# EAGLE design shieldv1 (EAGLE 6.4)
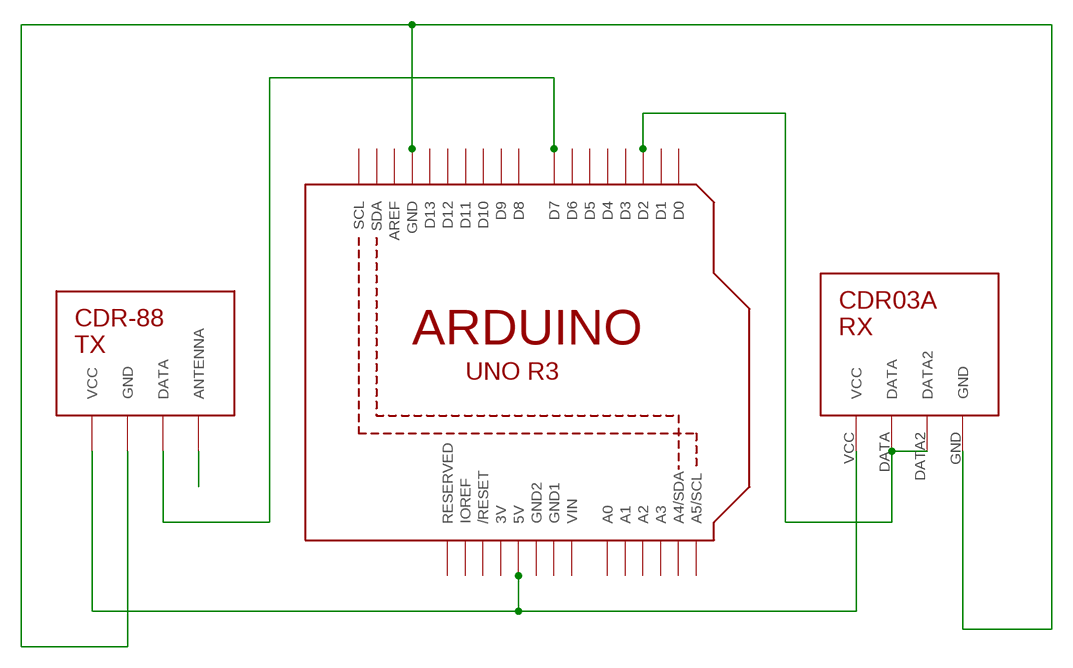
[diagram p0: schematic, sheet 1]

## Parts
U2  ARDUINOR3-DIMENSION  [ARDUINOR3]
U$1  CDT-88  [CDT-88]
U$2  CDR03A  [CDR03A]

## Nets
N$1: U2.D7 U$1.DATA
N$2: U2.D2 U$2.DATA U$2.DATA2
N$5: U2.5V U$1.VCC U$2.VCC
N$7: U$1.ANTENNA
N$69: U2.GND U$1.GND U$2.GND
Unconnected: U2.A0 U2.A1 U2.A2 U2.A3 U2.A4(A4/SDA) U2.A5(A5/SCL) U2.AREF U2.D0 U2.D1 U2.D3 U2.D4 U2.D5 U2.D6 U2.D8 U2.D9 U2.D10 U2.D11 U2.D12 U2.D13 U2.IOREF U2.RESERVED U2.RESET(/RESET) U2.SCL U2.SDA

## Power pins joined to a net without a drawn wire
3V: U2.3V
GND1: U2.GND1
GND2: U2.GND2
VIN: U2.VIN

## Library data of the parts
U2 = adafruit:ARDUINOR3: This is a new object for the new Arduino R3 - with extra pins that you may want to use (such as IOref, and duplicated A4/A5
U$1 = RF-transrec:CDT-88
U$2 = RF-transrec:CDR03A

## Board
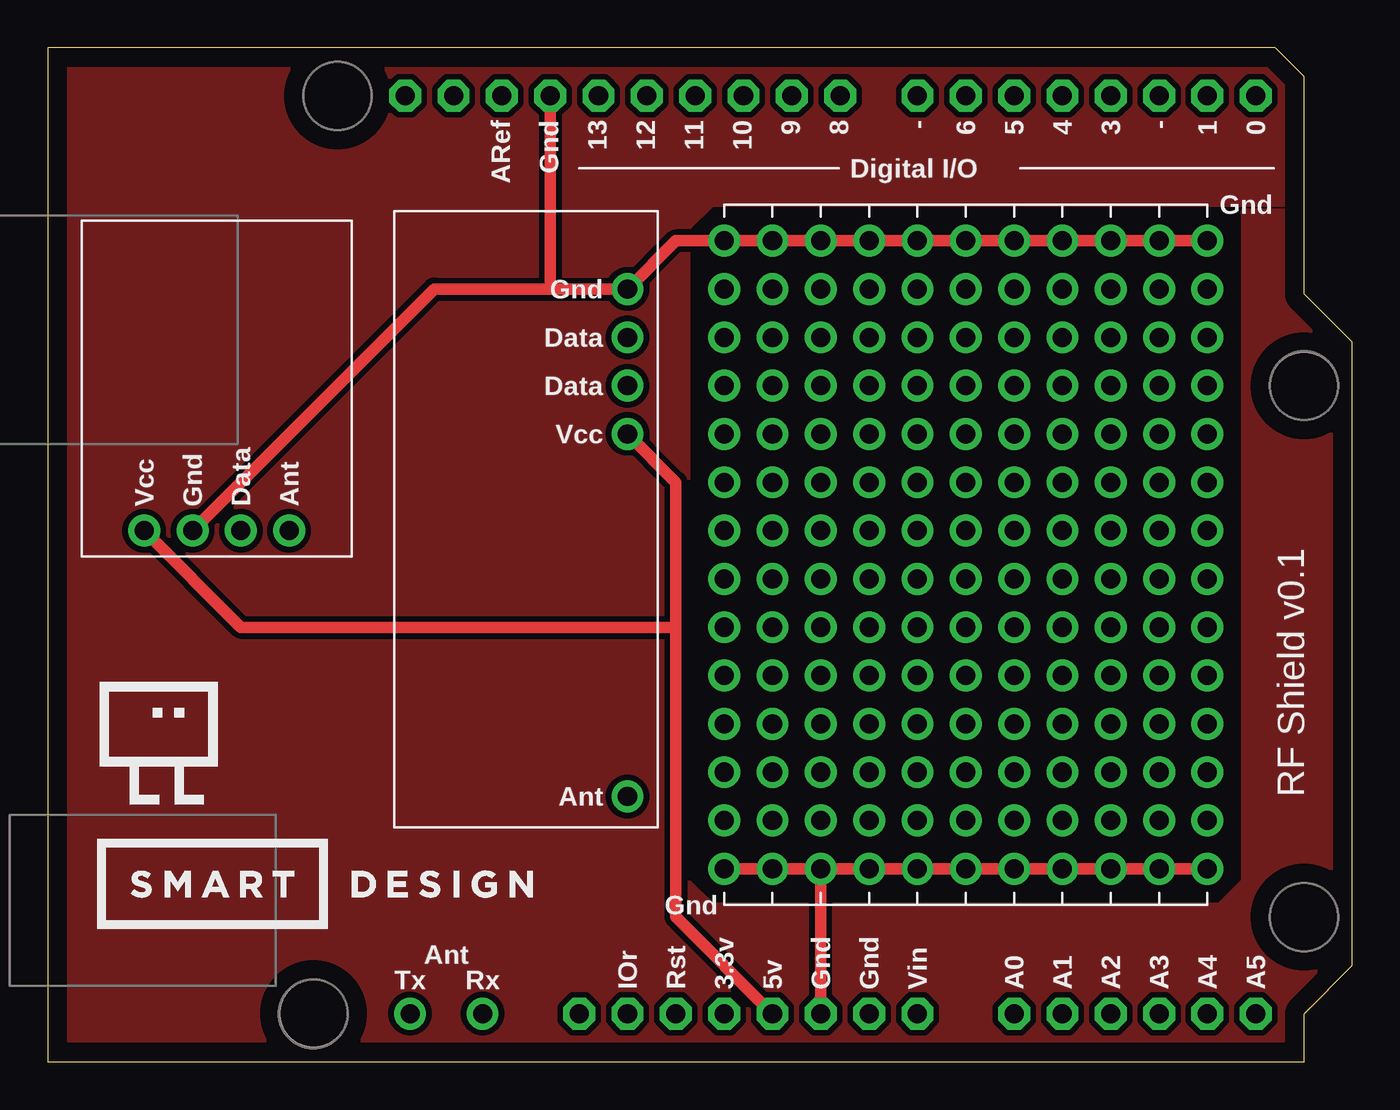
[diagram p1: board, top side]
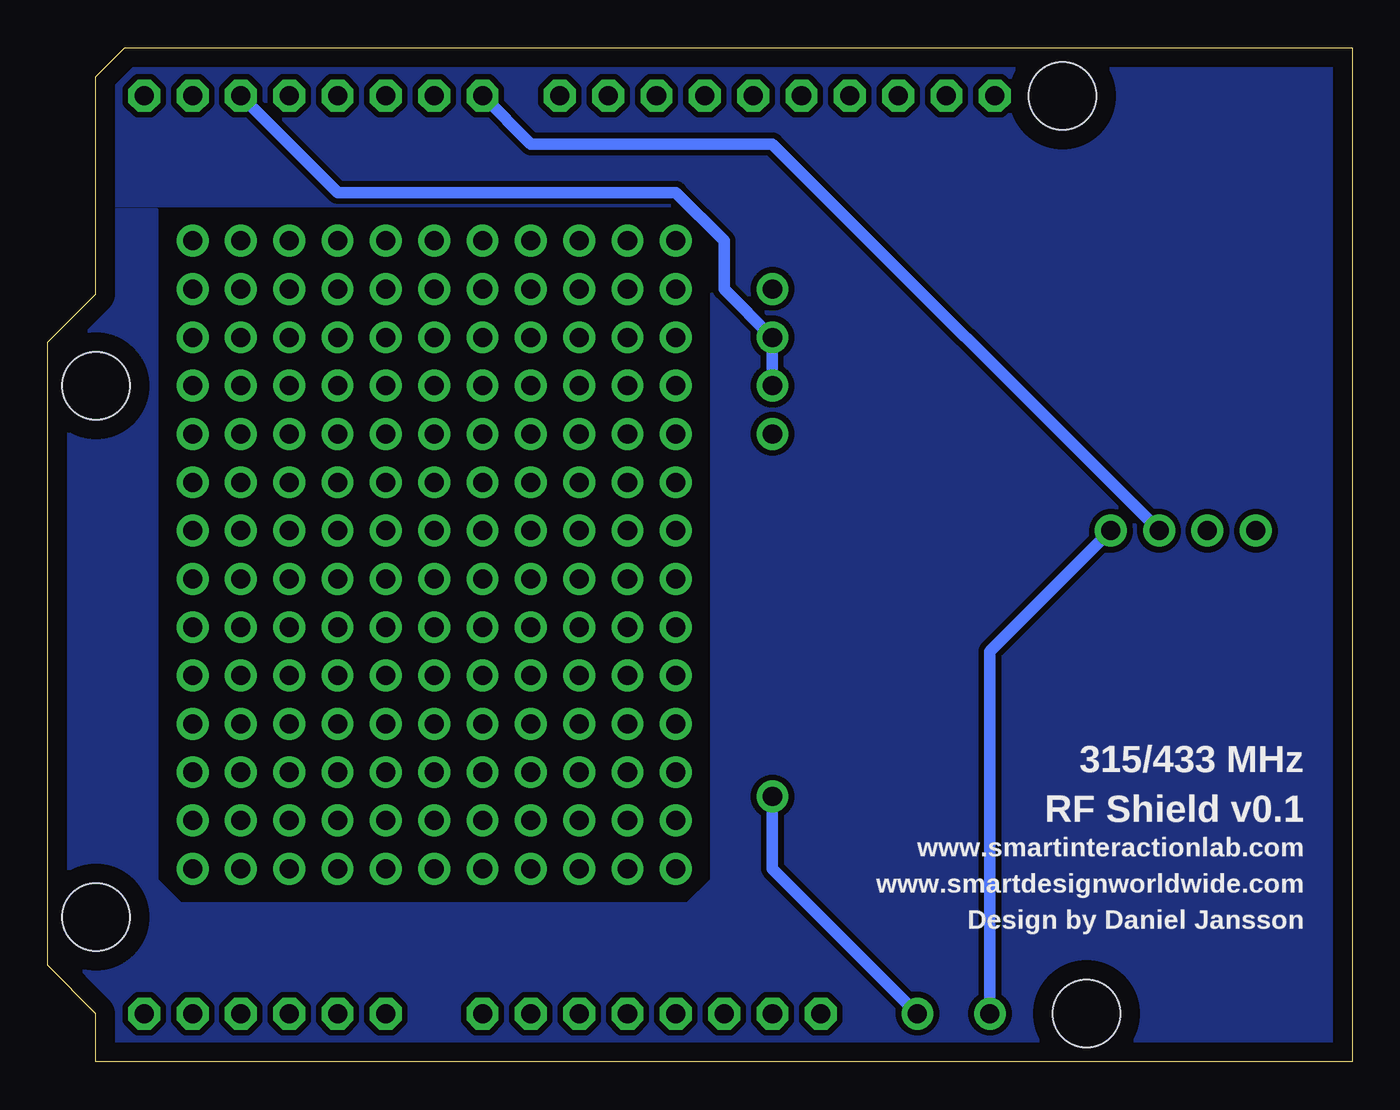
[diagram p2: board, bottom side, seen from below]

Size 68.58 x 53.34 mm. Coordinates in mm from the lower left corner, seen from the top.
Copper layers (1*16): Top 0.035mm / dielectric 1.5mm / Bottom 0.035mm
Design rules "default": minimum track width 10mil, minimum drill 24mil, track to track 8mil, track to pad 8mil, pad to pad 8mil, via to via 8mil, smd to smd 8mil, copper to edge 40mil, drill to drill 8mil, minimum pad ring 10mil, minimum via ring 8mil, stop-mask expansion 4mil, vias tented up to drill 0mil, thermal gap 10mil
Holes 3.56 mm at 13.97,2.54 66.04,7.62 66.04,35.56 15.24,50.8

### Footprints (pad centres in the part's own frame; a part is rotated, then mirrored left to right if it is on the bottom)
ARDUINOR3 = drill 1 pad 1.676 octagon: 3V 35.56,2.54; 5V 38.1,2.54; A0 50.8,2.54; A1 53.34,2.54; A2 55.88,2.54; A3 58.42,2.54; A4 60.96,2.54; A5 63.5,2.54; AREF 23.876,50.8; D0 63.5,50.8; D1 60.96,50.8; D2 58.42,50.8; D3 55.88,50.8; D4 53.34,50.8; D5 50.8,50.8; D6 48.26,50.8; D7 45.72,50.8; D8 41.656,50.8; D9 39.116,50.8; D10 36.576,50.8; D11 34.036,50.8; D12 31.496,50.8; D13 28.956,50.8; GND 26.416,50.8; GND1 43.18,2.54; GND2 40.64,2.54; IOREF 30.48,2.54; RESERVED 27.94,2.54; RESET 33.02,2.54; SCL 18.796,50.8; SDA 21.336,50.8; VIN 45.72,2.54
CDT-88 = drill 1 pad 1.676: ANTENNA 7.62,0; DATA 5.08,0; GND 2.54,0; VCC 0,0
CDR03A = drill 1 pad 1.676: DATA 2.54,0; DATA2 5.08,0; GND 7.62,0; P$2 -19.06,0; VCC 0,0

### Placement (x,y rotation side)
U2  0,0 0 top
U$1  5.08,27.94 0 top
U$2  30.48,33.02 90 top

### Tracks (layer width: path | path; a pad name or v marks a point on that pad's centre or on a via)
GND
  pour Top (isolate 0.305): 0,53.34 64.45,53.34 66.04,51.75 66.04,45.09 34.93,45.09 33.66,43.82 33.66,9.53 34.93,8.26 61.59,8.26 62.86,9.53 62.86,44.77 66.04,44.77 66.04,40.32 68.58,37.78 68.58,5.08 66.04,2.54 66.04,0 0,0
  pour Bottom (isolate 0.305): 0,53.34 64.45,53.34 66.04,51.75 66.04,45.09 34.93,45.09 33.66,43.82 33.66,9.53 34.93,8.26 61.59,8.26 62.86,9.53 62.86,44.77 66.04,44.77 66.04,40.32 68.58,37.78 68.58,5.08 66.04,2.54 66.04,0 0,0
GND2  (via drill 1 pad 1.68)
  Top 0.61: v35.56,10.16 v38.1,10.16 v40.64,10.16 | v40.64,10.16 v43.18,10.16 v45.72,10.16 v48.26,10.16 v50.8,10.16 v53.34,10.16 v55.88,10.16 v58.42,10.16 v60.96,10.16 | U2.GND2 v40.64,10.16
N$1
  Bottom 0.61: U2.D7 43.18,48.26 30.48,48.26 U$1.DATA
N$2
  Bottom 0.61: U2.D2 53.34,45.72 35.56,45.72 33.02,43.18 33.02,40.64 U$2.DATA2 U$2.DATA
N$4  (via drill 1 pad 1.68)
  Bottom 0.61: 30.48,13.97 30.48,10.16 v22.86,2.54
N$5
  Top 0.61: U$2.VCC 33.02,30.48 33.02,22.86 | 33.02,22.86 33.02,7.62 U2.5V | U$1.VCC 10.16,22.86 33.02,22.86
N$7  (via drill 1 pad 1.68)
  Bottom 0.61: U$1.ANTENNA 19.05,21.59 v19.05,2.54
N$27  (via drill 1 pad 1.68)
  other vias: 35.56,12.7
N$28  (via drill 1 pad 1.68)
  other vias: 38.1,12.7
N$29  (via drill 1 pad 1.68)
  other vias: 40.64,12.7
N$30  (via drill 1 pad 1.68)
  other vias: 43.18,12.7
N$31  (via drill 1 pad 1.68)
  other vias: 45.72,12.7
N$32  (via drill 1 pad 1.68)
  other vias: 48.26,12.7
N$33  (via drill 1 pad 1.68)
  other vias: 53.34,12.7
N$34  (via drill 1 pad 1.68)
  other vias: 50.8,12.7
N$35  (via drill 1 pad 1.68)
  other vias: 55.88,12.7
N$36  (via drill 1 pad 1.68)
  other vias: 58.42,12.7
N$37  (via drill 1 pad 1.68)
  other vias: 60.96,12.7
N$38  (via drill 1 pad 1.68)
  other vias: 60.96,15.24
N$39  (via drill 1 pad 1.68)
  other vias: 58.42,15.24
N$40  (via drill 1 pad 1.68)
  other vias: 55.88,15.24
N$41  (via drill 1 pad 1.68)
  other vias: 53.34,15.24
N$42  (via drill 1 pad 1.68)
  other vias: 50.8,15.24
N$43  (via drill 1 pad 1.68)
  other vias: 48.26,15.24
N$44  (via drill 1 pad 1.68)
  other vias: 45.72,15.24
N$45  (via drill 1 pad 1.68)
  other vias: 43.18,15.24
N$46  (via drill 1 pad 1.68)
  other vias: 40.64,15.24
N$47  (via drill 1 pad 1.68)
  other vias: 38.1,15.24
N$48  (via drill 1 pad 1.68)
  other vias: 35.56,15.24
N$49  (via drill 1 pad 1.68)
  other vias: 35.56,17.78
N$50  (via drill 1 pad 1.68)
  other vias: 38.1,17.78
N$51  (via drill 1 pad 1.68)
  other vias: 40.64,17.78
N$52  (via drill 1 pad 1.68)
  other vias: 43.18,17.78
N$53  (via drill 1 pad 1.68)
  other vias: 45.72,17.78
N$54  (via drill 1 pad 1.68)
  other vias: 48.26,17.78
N$55  (via drill 1 pad 1.68)
  other vias: 50.8,17.78
N$56  (via drill 1 pad 1.68)
  other vias: 53.34,17.78
N$57  (via drill 1 pad 1.68)
  other vias: 55.88,17.78
N$58  (via drill 1 pad 1.68)
  other vias: 58.42,17.78
N$59  (via drill 1 pad 1.68)
  other vias: 60.96,17.78
N$60  (via drill 1 pad 1.68)
  other vias: 35.56,20.32
N$61  (via drill 1 pad 1.68)
  other vias: 35.56,22.86
N$62  (via drill 1 pad 1.68)
  other vias: 35.56,25.4
N$63  (via drill 1 pad 1.68)
  other vias: 35.56,27.94
N$64  (via drill 1 pad 1.68)
  other vias: 35.56,30.48
N$65  (via drill 1 pad 1.68)
  other vias: 35.56,33.02
N$66  (via drill 1 pad 1.68)
  other vias: 35.56,35.56
N$67  (via drill 1 pad 1.68)
  other vias: 35.56,38.1
N$68  (via drill 1 pad 1.68)
  other vias: 35.56,40.64
N$69  (via drill 1 pad 1.68)
  Top 0.254: 26.42,40.64
  Top 0.61: v60.96,43.18 v58.42,43.18 v55.88,43.18 v53.34,43.18 v50.8,43.18 v48.26,43.18 v45.72,43.18 v43.18,43.18 v40.64,43.18 v38.1,43.18 v35.56,43.18 33.02,43.18 U$2.GND 26.42,40.64 20.32,40.64 U$1.GND | U2.GND 26.42,40.64
N$82  (via drill 1 pad 1.68)
  other vias: 60.96,40.64
N$83  (via drill 1 pad 1.68)
  other vias: 60.96,38.1
N$84  (via drill 1 pad 1.68)
  other vias: 60.96,35.56
N$85  (via drill 1 pad 1.68)
  other vias: 60.96,33.02
N$86  (via drill 1 pad 1.68)
  other vias: 60.96,30.48
N$87  (via drill 1 pad 1.68)
  other vias: 60.96,27.94
N$88  (via drill 1 pad 1.68)
  other vias: 60.96,25.4
N$89  (via drill 1 pad 1.68)
  other vias: 60.96,22.86
N$90  (via drill 1 pad 1.68)
  other vias: 60.96,20.32
N$91  (via drill 1 pad 1.68)
  other vias: 58.42,20.32
N$92  (via drill 1 pad 1.68)
  other vias: 55.88,20.32
N$93  (via drill 1 pad 1.68)
  other vias: 53.34,20.32
N$94  (via drill 1 pad 1.68)
  other vias: 50.8,20.32
N$95  (via drill 1 pad 1.68)
  other vias: 48.26,20.32
N$96  (via drill 1 pad 1.68)
  other vias: 45.72,20.32
N$97  (via drill 1 pad 1.68)
  other vias: 43.18,20.32
N$98  (via drill 1 pad 1.68)
  other vias: 40.64,20.32
N$99  (via drill 1 pad 1.68)
  other vias: 38.1,20.32
N$100  (via drill 1 pad 1.68)
  other vias: 38.1,22.86
N$101  (via drill 1 pad 1.68)
  other vias: 40.64,22.86
N$102  (via drill 1 pad 1.68)
  other vias: 43.18,22.86
N$103  (via drill 1 pad 1.68)
  other vias: 45.72,22.86
N$104  (via drill 1 pad 1.68)
  other vias: 50.8,22.86
N$105  (via drill 1 pad 1.68)
  other vias: 48.26,22.86
N$106  (via drill 1 pad 1.68)
  other vias: 53.34,22.86
N$107  (via drill 1 pad 1.68)
  other vias: 55.88,22.86
N$108  (via drill 1 pad 1.68)
  other vias: 58.42,22.86
N$109  (via drill 1 pad 1.68)
  other vias: 58.42,25.4
N$110  (via drill 1 pad 1.68)
  other vias: 55.88,25.4
N$111  (via drill 1 pad 1.68)
  other vias: 53.34,25.4
N$112  (via drill 1 pad 1.68)
  other vias: 50.8,25.4
N$113  (via drill 1 pad 1.68)
  other vias: 48.26,25.4
N$114  (via drill 1 pad 1.68)
  other vias: 45.72,25.4
N$115  (via drill 1 pad 1.68)
  other vias: 43.18,25.4
N$116  (via drill 1 pad 1.68)
  other vias: 40.64,25.4
N$117  (via drill 1 pad 1.68)
  other vias: 38.1,25.4
N$118  (via drill 1 pad 1.68)
  other vias: 38.1,27.94
N$119  (via drill 1 pad 1.68)
  other vias: 40.64,27.94
N$120  (via drill 1 pad 1.68)
  other vias: 43.18,27.94
N$121  (via drill 1 pad 1.68)
  other vias: 45.72,27.94
N$122  (via drill 1 pad 1.68)
  other vias: 48.26,27.94
N$123  (via drill 1 pad 1.68)
  other vias: 50.8,27.94
N$124  (via drill 1 pad 1.68)
  other vias: 53.34,27.94
N$125  (via drill 1 pad 1.68)
  other vias: 55.88,27.94
N$126  (via drill 1 pad 1.68)
  other vias: 58.42,27.94
N$127  (via drill 1 pad 1.68)
  other vias: 58.42,30.48
N$128  (via drill 1 pad 1.68)
  other vias: 55.88,30.48
N$129  (via drill 1 pad 1.68)
  other vias: 53.34,30.48
N$130  (via drill 1 pad 1.68)
  other vias: 50.8,30.48
N$131  (via drill 1 pad 1.68)
  other vias: 48.26,30.48
N$132  (via drill 1 pad 1.68)
  other vias: 45.72,30.48
N$133  (via drill 1 pad 1.68)
  other vias: 43.18,30.48
N$134  (via drill 1 pad 1.68)
  other vias: 40.64,30.48
N$135  (via drill 1 pad 1.68)
  other vias: 38.1,30.48
N$136  (via drill 1 pad 1.68)
  other vias: 38.1,33.02
N$137  (via drill 1 pad 1.68)
  other vias: 40.64,33.02
N$138  (via drill 1 pad 1.68)
  other vias: 43.18,33.02
N$139  (via drill 1 pad 1.68)
  other vias: 45.72,33.02
N$140  (via drill 1 pad 1.68)
  other vias: 48.26,33.02
N$141  (via drill 1 pad 1.68)
  other vias: 50.8,33.02
N$142  (via drill 1 pad 1.68)
  other vias: 53.34,33.02
N$143  (via drill 1 pad 1.68)
  other vias: 55.88,33.02
N$144  (via drill 1 pad 1.68)
  other vias: 58.42,33.02
N$145  (via drill 1 pad 1.68)
  other vias: 58.42,35.56
N$146  (via drill 1 pad 1.68)
  other vias: 55.88,35.56
N$147  (via drill 1 pad 1.68)
  other vias: 53.34,35.56
N$148  (via drill 1 pad 1.68)
  other vias: 50.8,35.56
N$149  (via drill 1 pad 1.68)
  other vias: 48.26,35.56
N$150  (via drill 1 pad 1.68)
  other vias: 45.72,35.56
N$151  (via drill 1 pad 1.68)
  other vias: 43.18,35.56
N$152  (via drill 1 pad 1.68)
  other vias: 40.64,35.56
N$153  (via drill 1 pad 1.68)
  other vias: 38.1,35.56
N$154  (via drill 1 pad 1.68)
  other vias: 38.1,38.1
N$155  (via drill 1 pad 1.68)
  other vias: 40.64,38.1
N$156  (via drill 1 pad 1.68)
  other vias: 43.18,38.1
N$157  (via drill 1 pad 1.68)
  other vias: 45.72,38.1
N$158  (via drill 1 pad 1.68)
  other vias: 48.26,38.1
N$160  (via drill 1 pad 1.68)
  other vias: 50.8,38.1
N$161  (via drill 1 pad 1.68)
  other vias: 53.34,38.1
N$162  (via drill 1 pad 1.68)
  other vias: 55.88,38.1
N$163  (via drill 1 pad 1.68)
  other vias: 58.42,38.1
N$164  (via drill 1 pad 1.68)
  other vias: 58.42,40.64
N$165  (via drill 1 pad 1.68)
  other vias: 55.88,40.64
N$166  (via drill 1 pad 1.68)
  other vias: 53.34,40.64
N$167  (via drill 1 pad 1.68)
  other vias: 50.8,40.64
N$168  (via drill 1 pad 1.68)
  other vias: 48.26,40.64
N$169  (via drill 1 pad 1.68)
  other vias: 45.72,40.64
N$170  (via drill 1 pad 1.68)
  other vias: 43.18,40.64
N$171  (via drill 1 pad 1.68)
  other vias: 40.64,40.64
N$172  (via drill 1 pad 1.68)
  other vias: 38.1,40.64

### Text on the board
tPlace: Gnd | RF Shield v0.1 | Gnd | Ant | Tx | Rx
bPlace: 315/433 MHz | RF Shield v0.1 | www.smartinteractionlab.com | www.smartdesignworldwide.com | Design by Daniel Jansson